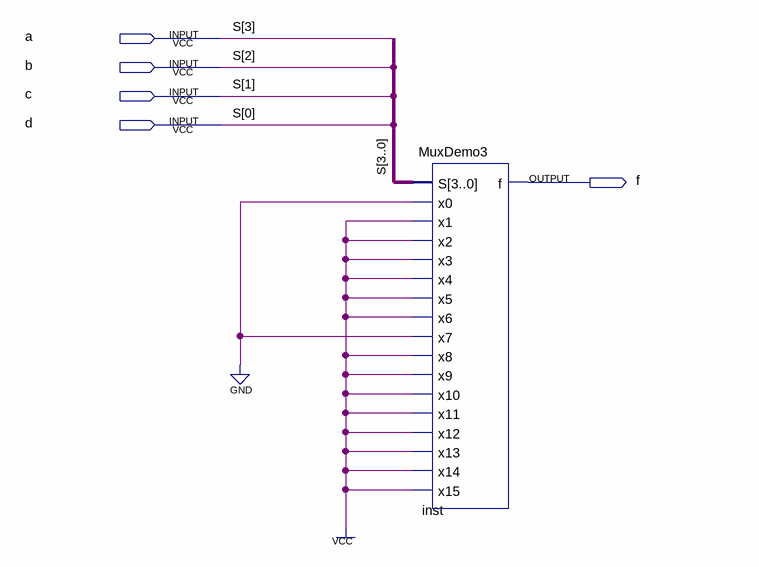
[diagram p0: schematic sheet]
// Quartus schematic MuxDemo4.bdf as structural Verilog: 1 symbols, 5 pins
module MuxDemo4 (
  input  a,
  input  b,
  input  c,
  input  d,
  output f
);

  MuxDemo3 inst (
    .S({a, b, c, d}), .x0(1'b0), .x1(1'b1), .x2(1'b1), .x3(1'b1), .x4(1'b1), .x5(1'b1), .x6(1'b1), .x7(1'b0),
    .x8(1'b1), .x9(1'b1), .x10(1'b1), .x11(1'b1), .x12(1'b1), .x13(1'b1), .x14(1'b1), .x15(1'b1), .f(f));

  // Other names for the same wires on the sheet: S[3:0] = {a, b, c, d}
endmodule
